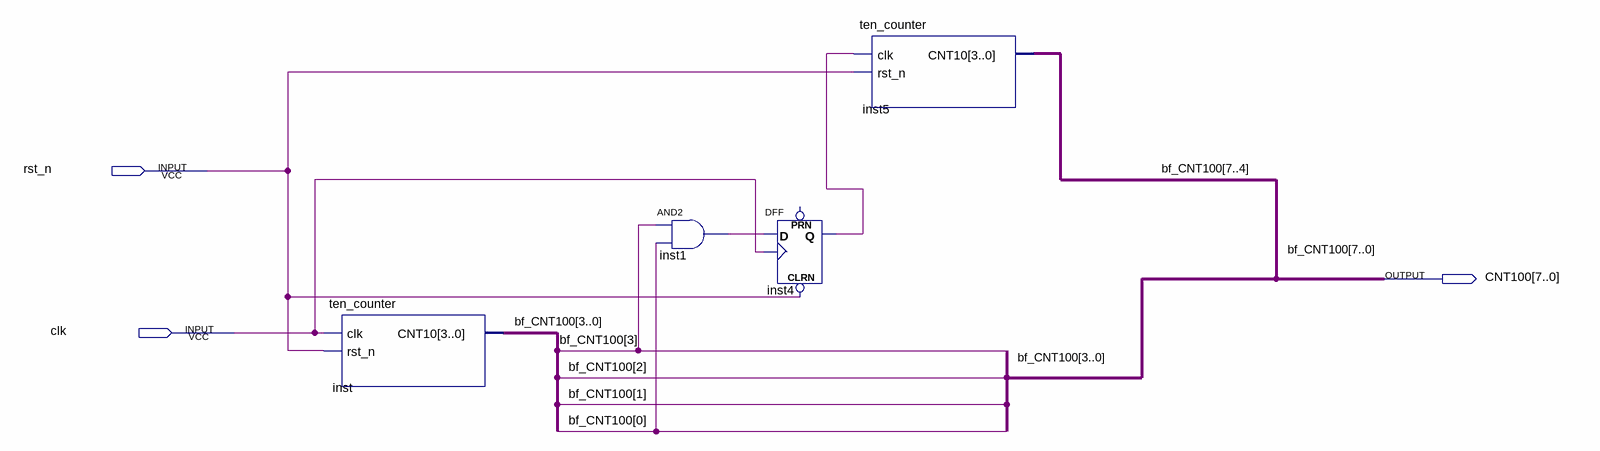
[diagram p0: schematic sheet]
// Quartus schematic countHundred.bdf as structural Verilog: 4 symbols, 3 pins
module countHundred (
  input  rst_n,
  input  clk,
  output [7:0] CNT100
);

  wire inst1_out, inst4_q;

  ten_counter inst (.clk(clk), .rst_n(rst_n), .CNT10(CNT100[3:0]));
  and inst1 (inst1_out, CNT100[3], CNT100[0]);
  DFF inst4 (.CLRN(rst_n), .CLK(clk), .D(inst1_out), .Q(inst4_q));  // open: PRN
  ten_counter inst5 (.clk(inst4_q), .rst_n(rst_n), .CNT10(CNT100[7:4]));

  // Other names for the same wires on the sheet: bf_CNT100[7:0] = CNT100
endmodule
